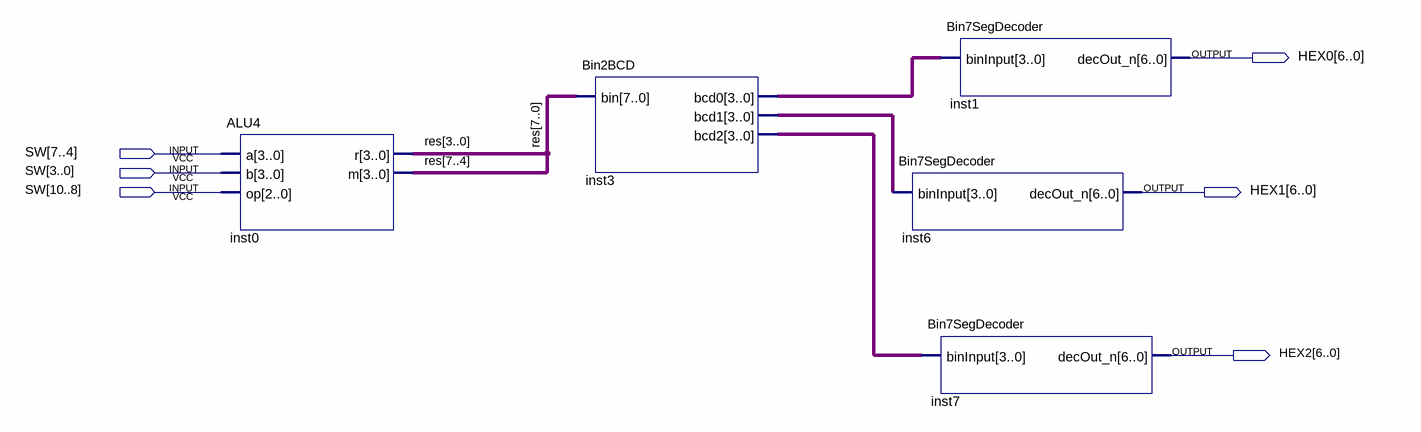
[diagram p0: schematic sheet]
// Quartus schematic ALU_Demo.bdf as structural Verilog: 5 symbols, 6 pins
module ALU_Demo (
  input  [10:0] SW,
  output [6:0] HEX0,
  output [6:0] HEX1,
  output [6:0] HEX2
);

  wire [3:0] inst3_bcd0, inst3_bcd1, inst3_bcd2;
  wire [7:0] res;

  ALU4 inst0 (.a(SW[7:4]), .b(SW[3:0]), .op(SW[10:8]), .r(res[3:0]), .m(res[7:4]));
  Bin2BCD inst3 (.bin(res), .bcd0(inst3_bcd0), .bcd1(inst3_bcd1), .bcd2(inst3_bcd2));
  Bin7SegDecoder inst1 (.binInput(inst3_bcd0), .decOut_n(HEX0));
  Bin7SegDecoder inst6 (.binInput(inst3_bcd1), .decOut_n(HEX1));
  Bin7SegDecoder inst7 (.binInput(inst3_bcd2), .decOut_n(HEX2));
endmodule
